# Altium schematic sheet gateway.SchDoc
size A4
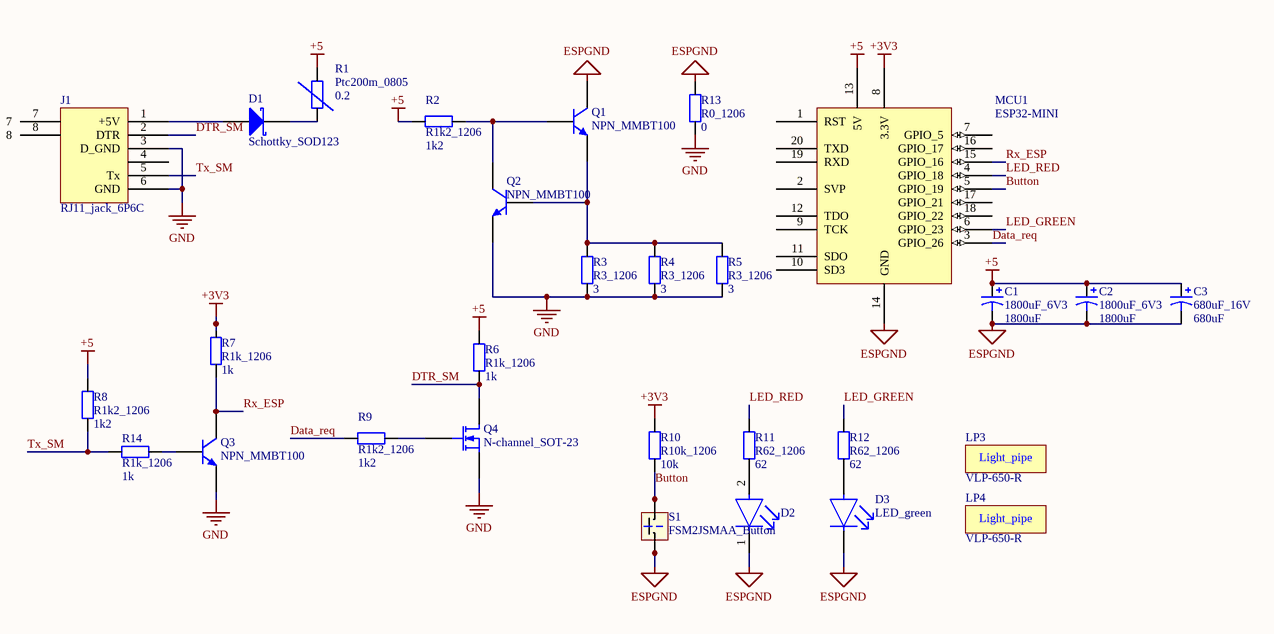
[diagram p0: gateway.SchDoc]

## Parts
C1  1800uF_6V3  value 1800uF  [CAPAE109103X105M_680uF]
C2  1800uF_6V3  value 1800uF  [CAPAE109103X105M_680uF]
C3  680uF_16V  value 680uF  [CAPAE109103X105M_680uF]
D1  Schottky_SOD123  [Diode_SOD-123]
D2  red led  [Kingbright_KPT-2012EC_0]  (value not drawn)
D3  LED_green  [Kingbright_KPT-2012EC_0]
J1  RJ11_jack_6P6C  [44144-0005]
LP3  VLP-650-R  [VLP-650-R]
LP4  VLP-650-R  [VLP-650-R]
MCU1  ESP32-MINI  [PINHEADERS_SMD_10]
Q1  NPN_MMBT100  [SOT95P245X110-3N]
Q2  NPN_MMBT100  [SOT95P245X110-3N]
Q3  NPN_MMBT100  [SOT95P245X110-3N]
Q4  N-channel_SOT-23  [SOT95P237X110-3N]
R1  Ptc200m_0805  value 0.2  [R0805]
R2  R1k2_1206  value 1k2  [R1206]
R3  R3_1206  value 3  [R1206]
R4  R3_1206  value 3  [R1206]
R5  R3_1206  value 3  [R1206]
R6  R1k_1206  value 1k  [R1206]
R7  R1k_1206  value 1k  [R1206]
R8  R1k2_1206  value 1k2  [R1206]
R9  R1k2_1206  value 1k2  [R1206]
R10  R10k_1206  value 10k  [R1206]
R11  R62_1206  value 62  [R1206]
R12  R62_1206  value 62  [R1206]
R13  R0_1206  value 0  [R1206]
R14  R1k_1206  value 1k  [R1206]
S1  FSM2JSMAA_Button  [FP-FSM2JSMAA-MFG]

## Nets
+3V3: MCU1.8(3.3V) R7.2 R10.2
+5: C1.1 C2.1 C3.1 MCU1.13(5V) R1.2 R2.1 R6.2 R8.2
ESPGND: C1.2 C2.2 C3.2 D2.1(C) D3.1(C) MCU1.14(GND) Q1.3(C) R13.2 S1.1(a) S1.3(c)
GND: J1.3(D_GND) J1.6(GND) Q2.1(E) Q3.1(E) Q4.3(S) R3.1 R4.1 R5.1 R13.1
Button: MCU1.5(GPIO_19) R10.1 S1.2(b) S1.4(d)
Data_req: MCU1.3(GPIO_26) R9.1
DTR_SM: J1.2(DTR) Q4.1(D) R6.1
LED_GREEN: MCU1.6(GPIO_23) R12.2
LED_RED: MCU1.4(GPIO_18) R11.2
Rx_ESP: MCU1.15(GPIO_16) Q3.3(C) R7.1
Tx_SM: J1.5(Tx) R8.1 R14.1
NetD1_1: D1.1(K) R1.1
NetD1_2: D1.2(A) J1.1(+5V)
NetD2_2: D2.2(A) R11.1
NetD3_2: D3.2(A) R12.1
NetQ1_1: Q1.1(E) Q2.2(B) R3.2 R4.2 R5.2
NetQ1_2: Q1.2(B) Q2.3(C) R2.2
NetQ3_2: Q3.2(B) R14.2
NetQ4_2: Q4.2(G) R9.2

Not connected (* = marked no-connect by the designer): J1 4 7 8; MCU1 1(RST) 2(SVP) 7(GPIO_5) 9(TCK) 10(SD3) 11(SDO) 12(TDO) 16(GPIO_17) 17(GPIO_21) 18(GPIO_22) 19(RXD) 20(TXD)

## Notes on the sheet
- (in symbol VLP-650-R) Light_pipe

## Library data of the parts
C1 C2 = 1800uF_6V3: SMD Aluminium Electrolytic Capacitor, Radial Can, 1800 µF, 10 V, 0.092 ohm, TRV Series; Manufacturer Part Number: EEE-FN0J182UV; Manufacturer: Panasonic; Capacitance: 1.8mF; Voltage Rating: 10V; Supplier Unit Price 1: €0.98708; Supplier Part Number 1: 667-EEE-FN0J182UV; Supplier 1: Mouser; Mount: Surface Mount; Category: Aluminum Electrolytic Capacitors
C3 = 680uF_16V: Aluminum Electrolytic Capacitors - SMD LOW ESR ELECTROLYTIC CAPACITORS; Manufacturer Part Number: 16TZV680M10X10.5; Manufacturer: Rubycon; Voltage Rating: 10V; Supplier Unit Price 1: €0.68594; Supplier Part Number 1: 232-16TZV680M10X10.5; Supplier 1: Mouser; Mount: Surface Mount; Category: Aluminum Electrolytic Capacitors; Case/Package: Radial
D1 = Schottky_SOD123: Schottky Rectifier, 20 V, 500 mA, Single, SOD-123, 2 Pins, 320 mV; pin to pad: 1>K 2>A; Manufacturer Part Number: STPS0520Z; Manufacturer: STMicroelectronics; Peak Non-Repetitive Surge Current: 5.5A; Output Current: 500mA; Max Reverse Voltage (DC): 20V; Forward Voltage: 320mV; Supplier Unit Price 1: €0.21607; Supplier Part Number 1: 511-STPS0520Z; Supplier 1: Mouser; Mount: Surface Mount; Forward Current: 500mA; Category: Rectifier Diodes
D2 = KPT-2012EC: KPT-2012EC -  LED, Low Power, Red, SMD, 0805 [2012 Metric], 30 mA, 2 V, 617 nm; Manufacturer Part Number: AP2012SRCPRV; Manufacturer: Kingbright; Forward Voltage: 1.85V; Forward Current: 20mA; Supplier Part Number 1: 604-AP2012SRCPRV; Supplier 1: Mouser; Mount: Surface Mount; Illumination Color: Red; Color: Red; Category: LEDs; Case/Package: 0805
D3 = LED_green: Standard LEDs - SMD GRN WATER CLEAR 0805; Manufacturer: Kingbright; Manufacturer Part Number: AP2012MGC; Color: Green; Forward Current: 20mA; Forward Voltage: 2.1V; Case/Package: 0805; Category: LEDs; Supplier 1: Mouser; Supplier Part Number 1: 604-AP2012MGC
J1 = RJ11_jack_6P6C: Modular Connector, RJ11 Jack, 1 x 1 (Port), 6P6C, Cat3, Surface Mount; Manufacturer: Molex; Gender: Female; Supplier Unit Price 1: €1.14; Supplier Part Number 1: 538-44144-0005; Supplier 1: Mouser; Termination: SMD/SMT; Mount: Surface Mount; Manufacturer Part Number: 44144-0005; Category: Modular / Ethernet Connectors; Supplier Packaging 1: Cut Tape
LP3 LP4 = VLP-650-R: LED Light Pipes Light Pipe Bd Mount SMD .65" Round Face; Manufacturer: Bivar; Case/Package: SMD/SMT; Manufacturer Part Number: VLP-650-R; Supplier 1: Mouser; Supplier Part Number 1: 749-VLP650R; Supplier Unit Price 1: €0.43073
MCU1 = ESP32-MINI: LilyGO TTGO T7 Mini32 V1.4 ESP32-WROVER; Manufacturer Part Number: 10129380-910002ALF; ComponentLink1Description: Manufacturer; ComponentLink1URL: https://www.tinytronics.nl/shop/nl/platforms/ttgo/lilygo-ttgo-t7-mini32-v1.4-esp32-wrover; Supplier Unit Price 1: €0.23406; Supplier Part Number 1: 649-1012938091002ALF; Supplier 1: Mouser
Q1-Q3 = NPN_MMBT100: Bipolar (BJT) Single Transistor, NPN, 45 V, 500 mA, 350 mW, SOT-23, Surface Mount; Manufacturer: ON Semiconductor / Fairchild; Voltage Rating (DC): 45V; Power Dissipation: 350mW; Max Frequency: 1MHz; Max Collector Current: 500mA; hFE Min: 100; Emitter Base Voltage (VEBO): 6V; Supplier Unit Price 1: €0.15259; Supplier Part Number 1: 512-MMBT100; Supplier 1: Mouser; Polarity: NPN; Mount: Surface Mount; Max Power Dissipation: 350mW; Manufacturer Part Number: MMBT100; Max Breakdown Voltage: 45V; Collector Emitter Voltage (VCEO): 45V; Category: BJTs
Q4 = N-channel_SOT-23: Power MOSFET, N Channel, 60 V, 260 mA, 1 ohm, SOT-23, Surface Mount; Manufacturer Part Number: NTR5103NT1G; Manufacturer: ON Semiconductor; Max Power Dissipation: 300mW; FET Type: 1 N-Channel; Supplier Unit Price 1: €0.14925; Supplier Part Number 1: 863-NTR5103NT1G; Supplier 1: Mouser; Mount: Surface Mount; Category: MOSFETs; Case/Package: SOT-23-3
R1 = Ptc200m_0805: Thermistor, PTC, SMD, 0805, 0.2 OHM; Manufacturer Part Number: PRG21BC0R2MM1RA; Manufacturer: Murata; Hold Current: 500mA; Resistance: 200mR; Tolerance: 20%; Supplier Unit Price 1: €0.44997; Supplier 1: Mouser; Supplier Part Number 1: 81-PRG21BC0R2MM1RA; Termination: SMD/SMT; Mount: Surface Mount; Category: PTC Resettable Fuses; Case/Package: 0805; Case Code (Imperial): 0805; Case Code (Metric): 2012
R2 R8 R9 = R1k2_1206: Thick Film Resistors - SMD 1206 1.2Kohms 1% AEC-Q200; Manufacturer: Panasonic; Manufacturer Part Number: ERJ-8ENF1201V; Max Power Dissipation: 250mW; Resistance: 1.2kR; Supplier 1: Mouser; Supplier Part Number 1: 667-ERJ-8ENF1201V; Supplier Unit Price 1: €0.08359; Case/Package: 1206; Case Code (Imperial): 1206; Category: Chip SMD Resistors; Mount: Surface Mount; Power Rating: 250mW; Tolerance: 1%
R3-R5 = R3_1206: Current Sense Resistors - SMD 1206 3.0ohm 1% Curr Sense AEC-Q200; Manufacturer Part Number: ERJ8RQF3R0V; Manufacturer: Panasonic; Power Rating: 250mW; Supplier 1: Mouser; Supplier Part Number 1: 667-ERJ-8RQF3R0V; Case/Package: 1206; Supplier Unit Price 1: €0.45139; Case Code (Imperial): 1206; Case Code (Metric): 3216; Category: Chip SMD Resistors; Mount: Surface Mount; Tolerance: 1%
R6 R7 R14 = R1k_1206: Thick Film Resistors - SMD 1206 1Kohms 1% Tol AEC-Q200; Manufacturer Part Number: ERJ-8ENF1001V; Manufacturer: Panasonic; Power Rating: 250mW; Supplier Unit Price 1: €0.01325; Supplier Part Number 1: 667-ERJ-8ENF1001V; Supplier 1: Mouser; Tolerance: 1%; Mount: Surface Mount; Case Code (Imperial): 1206; Case Code (Metric): 3216; Case/Package: 1206; Category: Chip SMD Resistors; Max Power Dissipation: 250mW
R10 = R10k_1206: Thick Film Resistors - SMD 1206 10Kohms 1% AEC-Q200; Manufacturer Part Number: ERJ-8ENF1002V; Manufacturer: Panasonic; Power Rating: 250mW; Supplier Unit Price 1: €0.01214; Supplier Part Number 1: 667-ERJ-8ENF1002V; Supplier 1: Mouser; Tolerance: 1%; Case Code (Imperial): 1206; Case Code (Metric): 3216; Case/Package: 1206; Category: Chip SMD Resistors; Max Power Dissipation: 250mW; Mount: Surface Mount
R11 R12 = R62_1206: Thick Film Resistors - SMD 1206 62ohms 1% AEC-Q200; Manufacturer Part Number: ERJ-8ENF62R0V; Manufacturer: Panasonic; Max Power Dissipation: 250mW; Supplier Unit Price 1: €0.00512; Supplier Part Number 1: 667-ERJ-8ENF62R0V; Supplier 1: Mouser; Tolerance: 1%; Mount: Surface Mount; Case Code (Imperial): 1206; Case Code (Metric): 3216; Case/Package: 1206; Category: Chip SMD Resistors
S1 = FSM2JSMAA_Button: Tactile Switch, FSMJSM Series, Top Actuated, Surface Mount, Round Button, 260 gf, 50mA at 24VDC; Manufacturer: TE Connectivity; Connector Type: SMD/SMT; Voltage Rating (DC): 24V; Supplier Unit Price 1: €0.13022; Supplier 1: Mouser; Supplier Part Number 1: 506-2-1437565-8; Mount: Surface Mount; Manufacturer Part Number: FSM2JSMAA; Category: Pushbutton Switches; Case/Package: SMD/SMT